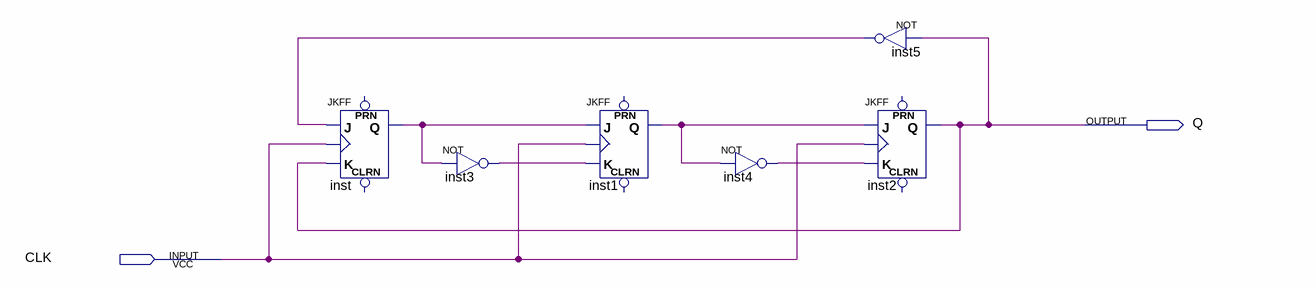
[diagram p0: schematic sheet]
// Quartus schematic SixBushu.bdf as structural Verilog: 6 symbols, 2 pins
module SixBushu (
  input  CLK,
  output Q
);

  wire inst1_q, inst3_out, inst4_out, inst5_out, inst_q;

  JKFF inst (.K(Q), .J(inst5_out), .CLK(CLK), .Q(inst_q));  // open: PRN, CLRN
  not inst3 (inst3_out, inst_q);
  JKFF inst1 (.K(inst3_out), .J(inst_q), .CLK(CLK), .Q(inst1_q));  // open: PRN, CLRN
  not inst4 (inst4_out, inst1_q);
  not inst5 (inst5_out, Q);
  JKFF inst2 (.K(inst4_out), .J(inst1_q), .CLK(CLK), .Q(Q));  // open: PRN, CLRN
endmodule
